# EAGLE design MOD-V_V10 (EAGLE 9.6.2)
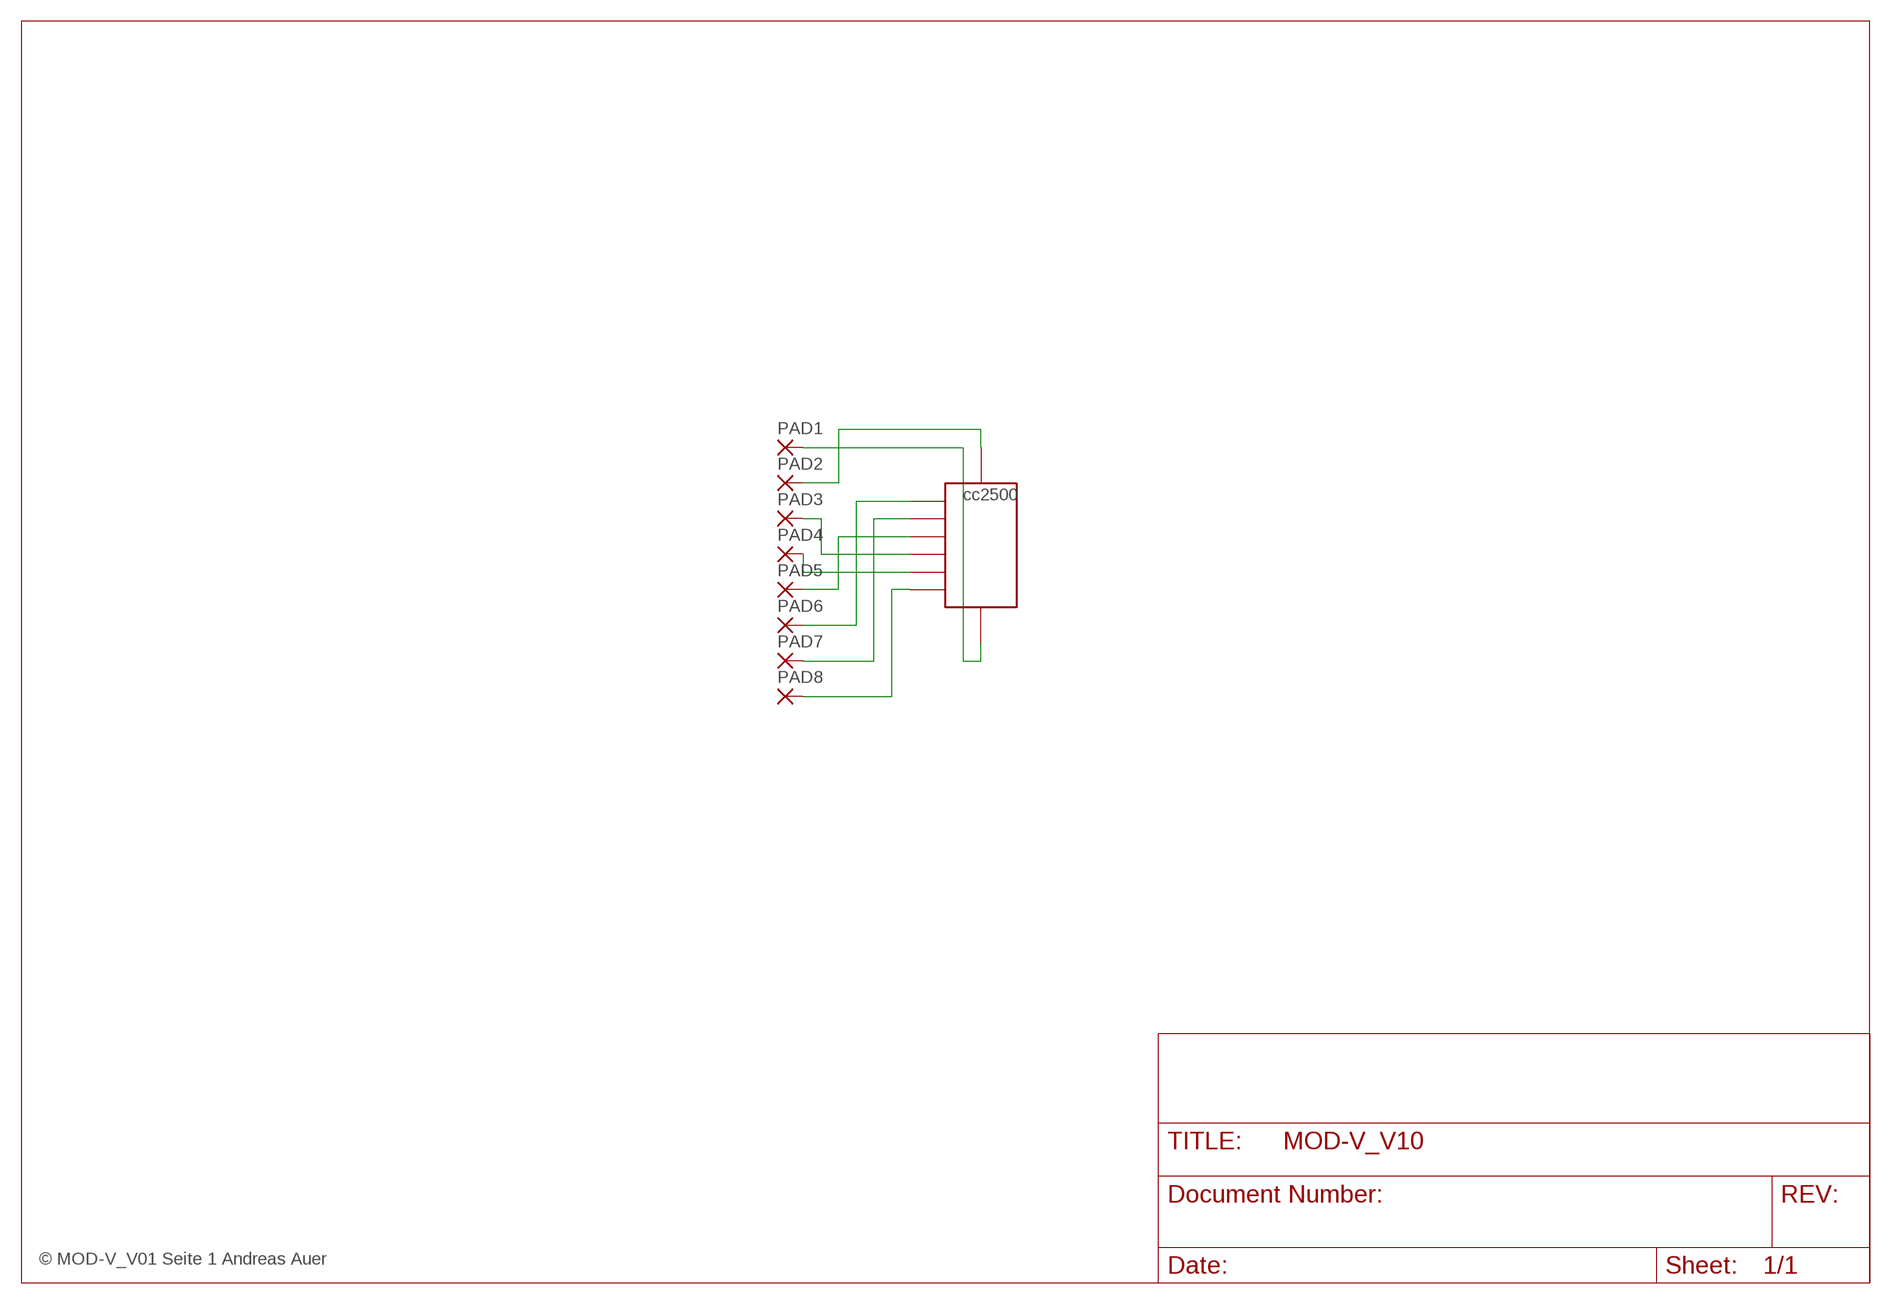
[diagram p0: schematic, sheet 1]

## Parts
IC1  CC2500  [CC2500]
PAD1  SMD2  [SMD1,27-2,54]
PAD2  SMD2  [SMD1,27-2,54]
PAD3  SMD2  [SMD1,27-2,54]
PAD4  SMD2  [SMD1,27-2,54]
PAD5  SMD2  [SMD1,27-2,54]
PAD6  SMD2  [SMD1,27-2,54]
PAD7  SMD2  [SMD1,27-2,54]
PAD8  SMD2  [SMD1,27-2,54]

## Nets
N$1: IC1.GND PAD1.1(P)
N$2: IC1.+3V3 PAD2.1(P)
N$3: IC1.SPSCK PAD4.1(P)
N$4: IC1.MISO PAD5.1(P)
N$6: IC1.GD2 PAD7.1(P)
N$8: IC1.CS PAD8.1(P)
N$9: IC1.MOSI PAD3.1(P)
N$10: IC1.GD0 PAD6.1(P)

## Notes on the sheet
- © MOD-V_V01 Seite 1 Andreas Auer

## Library data of the parts
IC1 = Andreas:CC2500
PAD1-PAD8 = wirepad:SMD2: SMD PAD

## Board
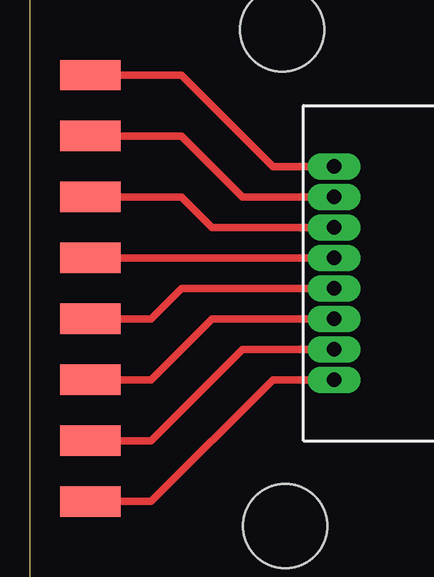
[diagram p1: board, top side]
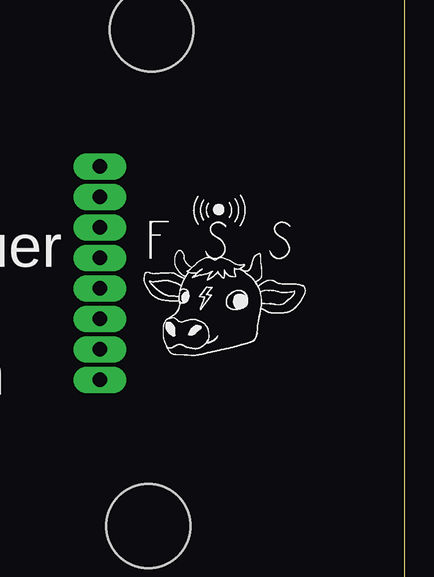
[diagram p2: board, bottom side, seen from below]

No outline drawn. Coordinates in mm, seen from the top.
Copper layers (1*16): Top 0.035mm / dielectric 1.5mm / Bottom 0.035mm
Design rules "default *": minimum track width 6mil, minimum drill 0.35mm, track to track 12mil, track to pad 12mil, pad to pad 12mil, via to via 12mil, smd to smd 12mil, copper to edge 40mil, drill to drill 23mil, minimum pad ring 10mil, minimum via ring 8mil, stop-mask expansion 4mil, vias tented up to drill 0mil, thermal gap 10mil
Holes 3.5 mm at 10.54,23.5 10.67,2.8 26.92,23.5 26.54,2.67
Milling: 4 lines

### Footprints (pad centres in the part's own frame; a part is rotated, then mirrored left to right if it is on the bottom)
CC2500 = drill 0.6 pad 1.016 long: +3V3 1.27,8.89; CS 1.27,1.27; GD0 1.27,2.54; GD2 1.27,3.81; GND 1.27,10.16; MISO 1.27,5.08; MOSI 1.27,7.62; SPSCK 1.27,6.35
SMD1,27-2,54 = smd 1.27 x 2.54: 1 0,0

### Placement (x,y rotation side)
IC1  11.43,7.62 0 top
PAD1  2.54,21.59 90 top
PAD2  2.54,19.05 90 top
PAD3  2.54,16.51 90 top
PAD4  2.54,13.97 90 top
PAD5  2.54,11.43 90 top
PAD6  2.54,6.35 90 top
PAD7  2.54,8.89 90 top
PAD8  2.54,3.81 90 top

### Tracks (layer width: path | path; a pad name or v marks a point on that pad's centre or on a via)
N$1
  Top 0.305: IC1.GND 10.16,17.78 6.35,21.59 PAD1.1
N$2
  Top 0.305: IC1.+3V3 8.89,16.51 6.35,19.05 PAD2.1
N$3
  Top 0.305: IC1.SPSCK PAD4.1
N$4
  Top 0.305: PAD5.1 5.08,11.43 6.35,12.7 IC1.MISO
N$6
  Top 0.305: IC1.GD2 7.62,11.43 5.08,8.89 PAD7.1
N$8
  Top 0.305: IC1.CS 10.16,8.89 5.08,3.81 PAD8.1
N$9
  Top 0.305: PAD3.1 6.35,16.51 7.62,15.24 IC1.MOSI
N$10
  Top 0.305: PAD6.1 5.08,6.35 8.89,10.16 IC1.GD0

### Text on the board
bPlace: FSS / Andreas Auer / 2021 / TFO-Meran